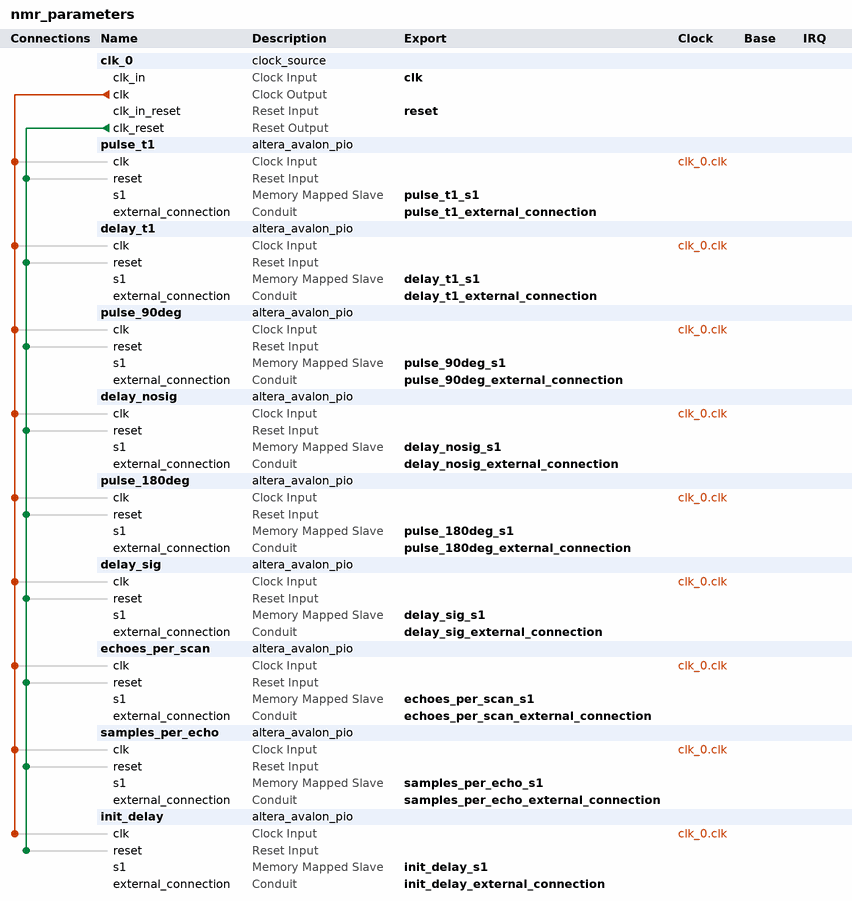
[diagram p0: system contents]
# Platform Designer (Qsys) system nmr_parameters, Cyclone V 5CSEMA5F31C6
# Parameters at their usual value, and those the tool derives, are not listed.
package require -exact qsys 17.1
create_system nmr_parameters
set_project_property DEVICE_FAMILY {Cyclone V}
set_project_property DEVICE 5CSEMA5F31C6

add_instance clk_0 clock_source 17.1
set_instance_parameter_value clk_0 clockFrequency 50000000

add_instance pulse_t1 altera_avalon_pio 17.1
set_instance_parameter_value pulse_t1 direction Output
set_instance_parameter_value pulse_t1 width 32

add_instance delay_t1 altera_avalon_pio 17.1
set_instance_parameter_value delay_t1 direction Output
set_instance_parameter_value delay_t1 width 32

add_instance pulse_90deg altera_avalon_pio 17.1
set_instance_parameter_value pulse_90deg direction Output
set_instance_parameter_value pulse_90deg resetValue 16
set_instance_parameter_value pulse_90deg width 32

add_instance delay_nosig altera_avalon_pio 17.1
set_instance_parameter_value delay_nosig direction Output
set_instance_parameter_value delay_nosig resetValue 16
set_instance_parameter_value delay_nosig width 32

add_instance pulse_180deg altera_avalon_pio 17.1
set_instance_parameter_value pulse_180deg direction Output
set_instance_parameter_value pulse_180deg resetValue 16
set_instance_parameter_value pulse_180deg width 32

add_instance delay_sig altera_avalon_pio 17.1
set_instance_parameter_value delay_sig direction Output
set_instance_parameter_value delay_sig resetValue 16
set_instance_parameter_value delay_sig width 32

add_instance echoes_per_scan altera_avalon_pio 17.1
set_instance_parameter_value echoes_per_scan direction Output
set_instance_parameter_value echoes_per_scan width 32

add_instance samples_per_echo altera_avalon_pio 17.1
set_instance_parameter_value samples_per_echo direction Output
set_instance_parameter_value samples_per_echo resetValue 255
set_instance_parameter_value samples_per_echo width 32

add_instance init_delay altera_avalon_pio 17.1
set_instance_parameter_value init_delay direction Output
set_instance_parameter_value init_delay width 32

# connections
add_connection clk_0.clk delay_nosig.clk clock
add_connection clk_0.clk delay_sig.clk clock
add_connection clk_0.clk delay_t1.clk clock
add_connection clk_0.clk echoes_per_scan.clk clock
add_connection clk_0.clk init_delay.clk clock
add_connection clk_0.clk pulse_90deg.clk clock
add_connection clk_0.clk pulse_180deg.clk clock
add_connection clk_0.clk pulse_t1.clk clock
add_connection clk_0.clk samples_per_echo.clk clock
add_connection clk_0.clk_reset delay_nosig.reset reset
add_connection clk_0.clk_reset delay_sig.reset reset
add_connection clk_0.clk_reset delay_t1.reset reset
add_connection clk_0.clk_reset echoes_per_scan.reset reset
add_connection clk_0.clk_reset init_delay.reset reset
add_connection clk_0.clk_reset pulse_90deg.reset reset
add_connection clk_0.clk_reset pulse_180deg.reset reset
add_connection clk_0.clk_reset pulse_t1.reset reset
add_connection clk_0.clk_reset samples_per_echo.reset reset

# exported interfaces
add_interface clk clock sink
set_interface_property clk EXPORT_OF clk_0.clk_in
add_interface delay_nosig_external_connection conduit end
set_interface_property delay_nosig_external_connection EXPORT_OF delay_nosig.external_connection
add_interface delay_nosig_s1 avalon slave
set_interface_property delay_nosig_s1 EXPORT_OF delay_nosig.s1
add_interface delay_sig_external_connection conduit end
set_interface_property delay_sig_external_connection EXPORT_OF delay_sig.external_connection
add_interface delay_sig_s1 avalon slave
set_interface_property delay_sig_s1 EXPORT_OF delay_sig.s1
add_interface delay_t1_external_connection conduit end
set_interface_property delay_t1_external_connection EXPORT_OF delay_t1.external_connection
add_interface delay_t1_s1 avalon slave
set_interface_property delay_t1_s1 EXPORT_OF delay_t1.s1
add_interface echoes_per_scan_external_connection conduit end
set_interface_property echoes_per_scan_external_connection EXPORT_OF echoes_per_scan.external_connection
add_interface echoes_per_scan_s1 avalon slave
set_interface_property echoes_per_scan_s1 EXPORT_OF echoes_per_scan.s1
add_interface init_delay_external_connection conduit end
set_interface_property init_delay_external_connection EXPORT_OF init_delay.external_connection
add_interface init_delay_s1 avalon slave
set_interface_property init_delay_s1 EXPORT_OF init_delay.s1
add_interface pulse_180deg_external_connection conduit end
set_interface_property pulse_180deg_external_connection EXPORT_OF pulse_180deg.external_connection
add_interface pulse_180deg_s1 avalon slave
set_interface_property pulse_180deg_s1 EXPORT_OF pulse_180deg.s1
add_interface pulse_90deg_external_connection conduit end
set_interface_property pulse_90deg_external_connection EXPORT_OF pulse_90deg.external_connection
add_interface pulse_90deg_s1 avalon slave
set_interface_property pulse_90deg_s1 EXPORT_OF pulse_90deg.s1
add_interface pulse_t1_external_connection conduit end
set_interface_property pulse_t1_external_connection EXPORT_OF pulse_t1.external_connection
add_interface pulse_t1_s1 avalon slave
set_interface_property pulse_t1_s1 EXPORT_OF pulse_t1.s1
add_interface reset reset sink
set_interface_property reset EXPORT_OF clk_0.clk_in_reset
add_interface samples_per_echo_external_connection conduit end
set_interface_property samples_per_echo_external_connection EXPORT_OF samples_per_echo.external_connection
add_interface samples_per_echo_s1 avalon slave
set_interface_property samples_per_echo_s1 EXPORT_OF samples_per_echo.s1

set_interconnect_requirement {$system} qsys_mm.clockCrossingAdapter HANDSHAKE
set_interconnect_requirement {$system} qsys_mm.enableEccProtection FALSE
set_interconnect_requirement {$system} qsys_mm.insertDefaultSlave FALSE
set_interconnect_requirement {$system} qsys_mm.maxAdditionalLatency 1

save_system nmr_parameters.qsys
